# EAGLE design Shield (EAGLE 9.2.2)
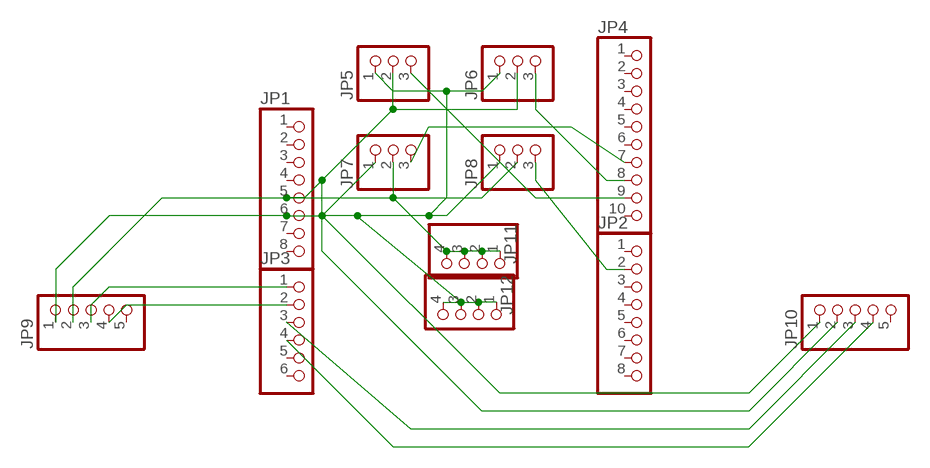
[diagram p0: schematic, sheet 1]

## Parts
JP1  PINHD-1X8  [1X08]
JP2  PINHD-1X8  [1X08]
JP3  PINHD-1X6  [1X06]
JP4  PINHD-1X10  [1X10]
JP5  PINHD-1X3  [1X03]
JP6  PINHD-1X3  [1X03]
JP7  PINHD-1X3  [1X03]
JP8  PINHD-1X3  [1X03]
JP9  PINHD-1X5  [1X05]
JP10  PINHD-1X5  [1X05]
JP11  PINHD-1X4  [1X04]
JP12  PINHD-1X4  [1X04]

## Nets
GND: JP1.6 JP5.1 JP6.1 JP7.1 JP8.1 JP9.1 JP10.1 JP12.1 JP12.2 JP12.3 JP12.4
N$1: JP1.5 JP5.2 JP6.2 JP7.2 JP8.2 JP9.2 JP10.2 JP11.1 JP11.2 JP11.3 JP11.4
N$2: JP4.9 JP5.3
N$3: JP3.1 JP9.3
N$4: JP4.8 JP6.3
N$5: JP3.2 JP9.4
N$6: JP3.3 JP10.3
N$7: JP3.4 JP10.4
N$9: JP2.2 JP8.3
N$10: JP4.7 JP7.3
Unconnected: JP1.1 JP1.2 JP1.3 JP1.4 JP1.7 JP1.8 JP2.1 JP2.3 JP2.4 JP2.5 JP2.6 JP2.7 JP2.8 JP3.5 JP3.6 JP4.1 JP4.2 JP4.3 JP4.4 JP4.5 JP4.6 JP4.10 JP9.5 JP10.5

## Library data of the parts
JP1 JP2 = pinhead:PINHD-1X8: PIN HEADER
JP3 = pinhead:PINHD-1X6: PIN HEADER
JP4 = pinhead:PINHD-1X10: PIN HEADER
JP5-JP8 = pinhead:PINHD-1X3: PIN HEADER
JP9 JP10 = pinhead:PINHD-1X5: PIN HEADER
JP11 JP12 = pinhead:PINHD-1X4: PIN HEADER

## Board
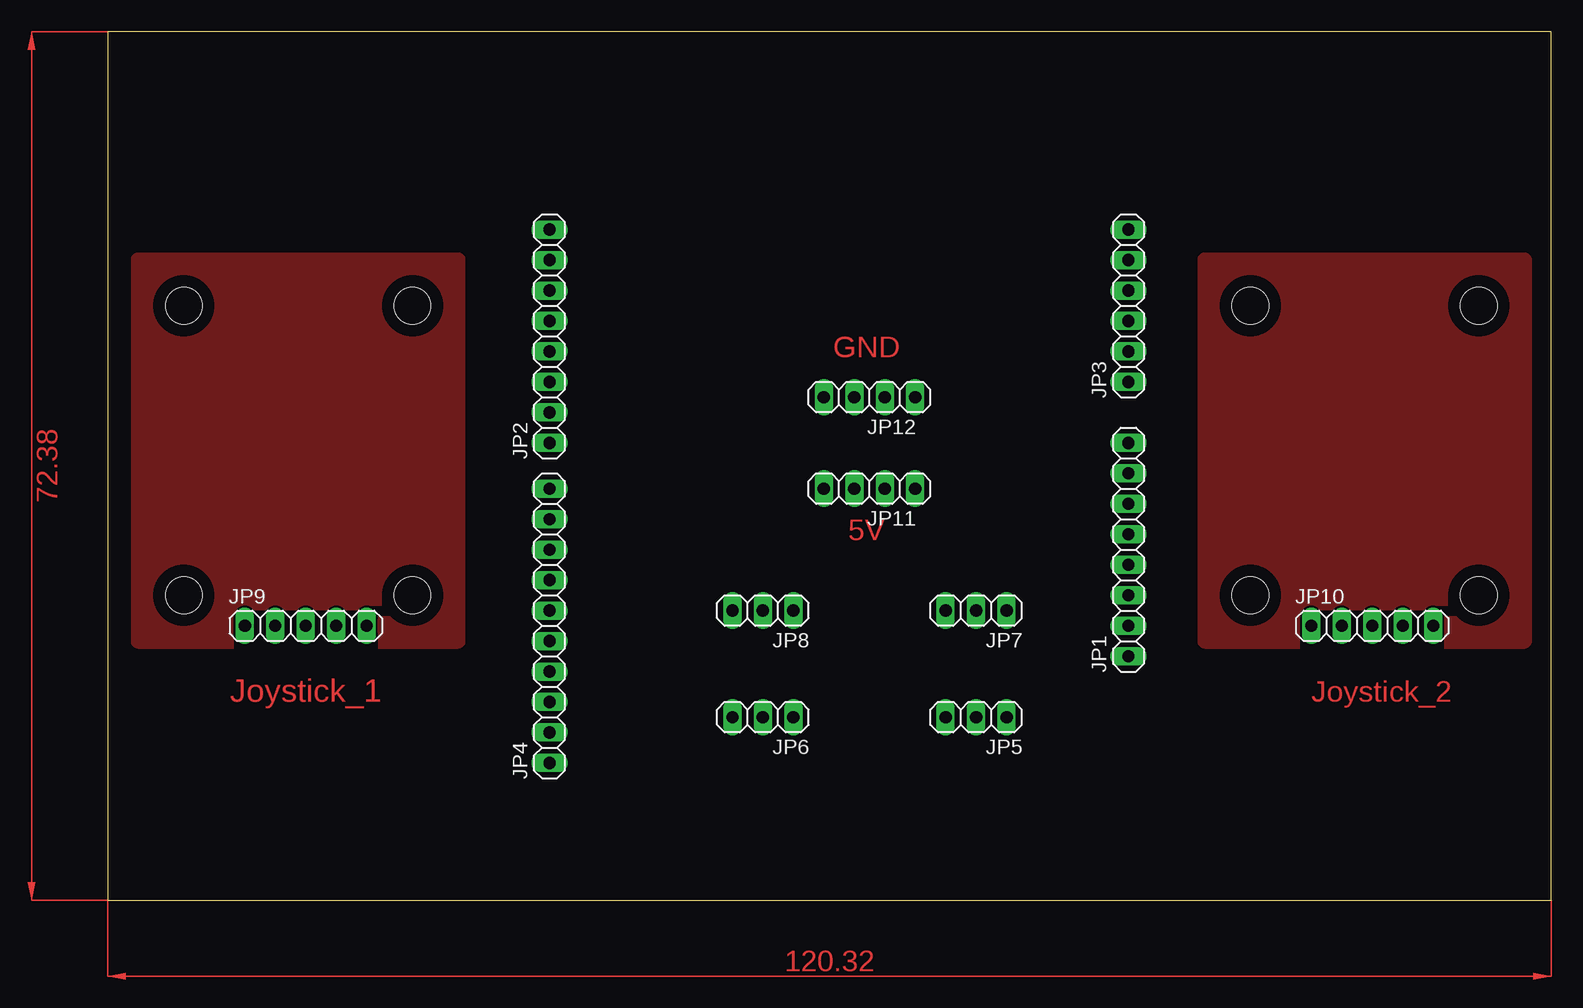
[diagram p1: board, top side]
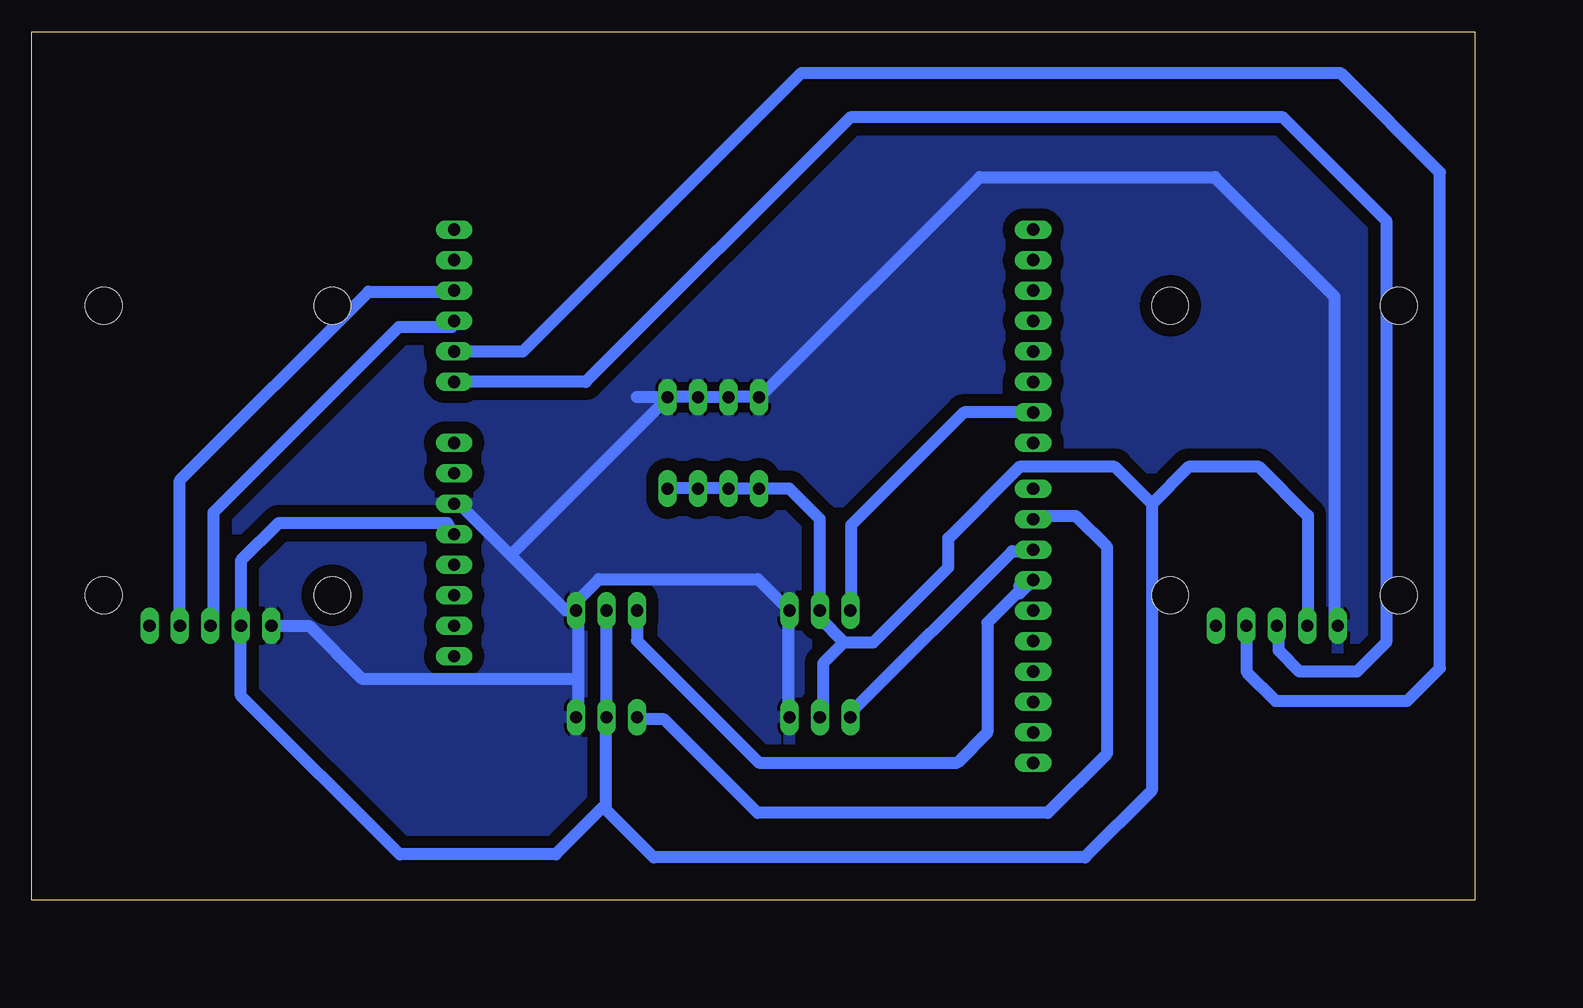
[diagram p2: board, bottom side, seen from below]

Size 120.32 x 72.38 mm. Coordinates in mm from the lower left corner, seen from the top.
Outline: 0,0 120.32,0 120.32,72.38 0,72.38 0,0
Copper layers (1*16): Top 0.035mm / dielectric 1.5mm / Bottom 0.035mm
Design rules "default *": minimum track width 40mil, minimum drill 0.35mm, track to track 6mil, track to pad 6mil, pad to pad 6mil, via to via 6mil, smd to smd 6mil, copper to edge 40mil, drill to drill 6mil, minimum pad ring 10mil, minimum via ring 8mil, stop-mask expansion 4mil, vias tented up to drill 0mil, thermal gap 10mil
Holes 3.05 mm at 6.35,49.53 25.4,49.53 6.35,25.4 25.4,25.4 95.25,49.53 114.3,49.53 95.25,25.4 114.3,25.4

### Footprints (pad centres in the part's own frame; a part is rotated, then mirrored left to right if it is on the bottom)
1X08 = drill 1.016 long: 1 -8.89,0; 2 -6.35,0; 3 -3.81,0; 4 -1.27,0; 5 1.27,0; 6 3.81,0; 7 6.35,0; 8 8.89,0
1X06 = drill 1.016 long: 1 -6.35,0; 2 -3.81,0; 3 -1.27,0; 4 1.27,0; 5 3.81,0; 6 6.35,0
1X10 = drill 1.016 long: 1 -11.43,0; 2 -8.89,0; 3 -6.35,0; 4 -3.81,0; 5 -1.27,0; 6 1.27,0; 7 3.81,0; 8 6.35,0; 9 8.89,0; 10 11.43,0
1X03 = drill 1.016 long: 1 -2.54,0; 2 0,0; 3 2.54,0
1X05 = drill 1.016 long: 1 -5.08,0; 2 -2.54,0; 3 0,0; 4 2.54,0; 5 5.08,0
1X04 = drill 1.016 long: 1 -3.81,0; 2 -1.27,0; 3 1.27,0; 4 3.81,0

### Placement (x,y rotation side)
JP1  85.09,29.21 90 top
JP2  36.83,46.99 90 top
JP3  85.09,49.53 90 top
JP4  36.83,22.86 90 top
JP5  72.39,15.24 180 top
JP6  54.61,15.24 180 top
JP7  72.39,24.13 180 top
JP8  54.61,24.13 180 top
JP9  16.51,22.86 0 top
JP10  105.41,22.86 0 top
JP11  63.5,34.29 180 top
JP12  63.5,41.91 180 top

### Tracks (layer width: path | path; a pad name or v marks a point on that pad's centre or on a via)
GND
  Bottom 1.016: JP6.1 57.25,15.65 57.25,23.82 JP8.1 59.77,26.75 73.03,26.75 74.78,24.99 JP7.1 | 74.78,18.47 74.78,23.82 JP7.1 | 74.78,18.47 74.78,15.65 JP5.1 | 80.38,28.74 75.77,24.13 JP7.1 | 80.38,28.74 84.91,33.27 JP1.6 | 74.78,18.47 92.79,18.47 97.18,22.86 JP10.1 | JP12.1 67.18,41.94 64.85,41.94 JP12.2 64.26,41.94 62.51,41.94 JP12.3 61.92,41.94 60.17,41.94 JP12.4 59.59,41.94 41.27,60.25 21.67,60.25 11.68,50.27 11.68,23.24 JP9.1 | 80.38,28.74 67.77,41.35 JP12.1 | JP12.1 69.85,41.91
  pour Bottom (isolate 1.016): 0,0 0,72.39 120.65,72.39 120.65,0
JOYSTICK_1
  pour Top: 2.54,21.59 29.21,21.59 29.21,53.34 2.54,53.34
JOYSTICK_2
  pour Top: 91.44,21.59 118.11,21.59 118.11,53.34 91.44,53.34
N$1
  Bottom 1.016: JP5.2 72.44,15.65 72.44,23.82 JP7.2 | JP1.5 85.67,31.42 99.72,31.42 102.87,28.27 JP10.2 102.87,17.04 89.64,3.81 76.64,3.81 72.67,7.78 72.45,7.56 | 72.44,14.48 72.44,15.06 JP5.2 | JP11.1 67.18,34.34 64.85,34.34 JP11.2 64.26,34.34 62.51,34.34 JP11.3 61.92,34.34 60.17,34.34 JP11.4 57.15,34.29 54.61,31.75 JP8.2 54.61,23.52 52.58,21.49 | 52.58,21.49 50.14,21.49 43.89,27.74 43.89,30.18 37.97,36.09 30.02,36.09 26.95,33.02 | JP6.2 54.33,15.65 54.33,19.74 52.58,21.49 | 72.45,7.56 68.45,3.56 32.51,3.56 26.95,9.12 26.95,33.02 | JP9.2 13.92,22.91 13.92,32.03 17.98,36.09 23.88,36.09 26.95,33.02 | JP5.2 72.45,15.18 72.45,7.56
N$2
  Bottom 1.016: JP5.3 69.52,15.06 67.59,15.06 59.79,7.26 35.64,7.26 30.66,12.24 30.66,29.39 33.27,32 36.8,32 JP4.9
N$3
  Bottom 1.016: JP9.3 16.36,22.66 16.36,20.8 14.61,19.05 9.83,19.05 7.39,21.49 7.39,56.62 16,65.23 52.07,65.23 74.12,43.18 JP3.1
N$4
  Bottom 1.016: JP4.8 37.39,29.08 38.56,29.08 51.99,15.65 JP6.3
N$5
  Bottom 1.016: JP3.2 79.35,45.72 56.13,68.94 11.23,68.94 2.92,60.63 2.92,19.33 5.64,16.61 16.61,16.61 19.05,19.05 JP9.4
N$6
  Bottom 1.016: JP3.3 85.29,47.78 89.69,47.78 105.16,32.31 105.16,23.24 JP10.3
N$7
  Bottom 1.016: JP3.4 85.29,50.7 92.23,50.7 107.95,34.98 JP10.4
N$9
  Bottom 1.016: JP8.3 51.99,24.41 51.99,31.24 42.6,40.64 JP2.2
N$10
  Bottom 1.016: 37.97,26.16 37.39,26.16 JP4.7 37.95,25.55 38.18,25.55 40.64,23.09 40.64,13.97 43.16,11.46 59.69,11.46 69.85,21.61 JP7.3
(copper drawn outside any net)
  shapes: Top area x2

### Text on the board
Top: GND | 5V | Joystick_1 | Joystick_2